# Altium schematic sheet Copy of MB1180.SchDoc: TOP
size A4; DocumentNumber: MB1180; Revision: C.1; SheetNumber: 1; SheetTotal: 3; Project: NUCLEO32
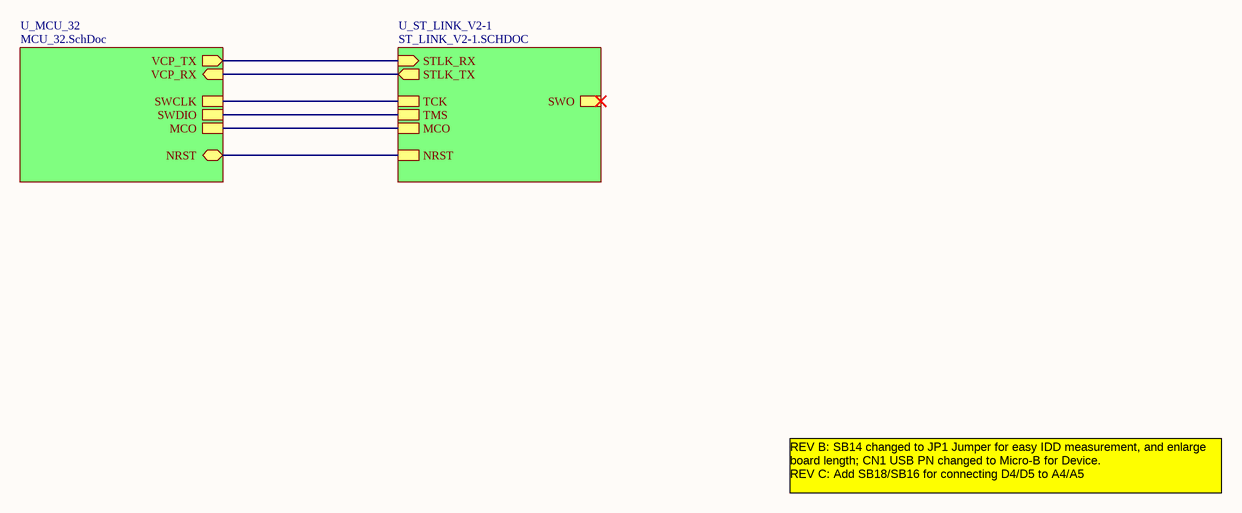
[diagram p0: Copy of MB1180.SchDoc]

## Sub-sheets
U_MCU_32 = MCU_32.SchDoc: MCO, VCP_TX (out), SWCLK, SWDIO, VCP_RX (in), NRST
U_ST_LINK_V2-1 = ST_LINK_V2-1.SCHDOC: TMS, TCK, MCO, NRST, STLK_RX (in), STLK_TX (out), SWO

## Nets
(unnamed): sheet U_MCU_32/MCO, sheet U_ST_LINK_V2-1/MCO
(unnamed): sheet U_MCU_32/VCP_TX, sheet U_ST_LINK_V2-1/STLK_RX
(unnamed): sheet U_MCU_32/SWCLK, sheet U_ST_LINK_V2-1/TCK
(unnamed): sheet U_MCU_32/SWDIO, sheet U_ST_LINK_V2-1/TMS
(unnamed): sheet U_MCU_32/VCP_RX, sheet U_ST_LINK_V2-1/STLK_TX
(unnamed): sheet U_MCU_32/NRST, sheet U_ST_LINK_V2-1/NRST

## Notes on the sheet
- REV B: SB14 changed to JP1 Jumper for easy IDD measurement, and enlarge board length; CN1 USB PN changed to Micro-B for Device.
  REV C: Add SB18/SB16 for connecting D4/D5 to A4/A5
- Title:
- Project:
- Size:
- Date:
- A4
- Reference:
- Sheet:
- Revision:
- of